# Altium schematic sheet RS232.SchDoc
size A
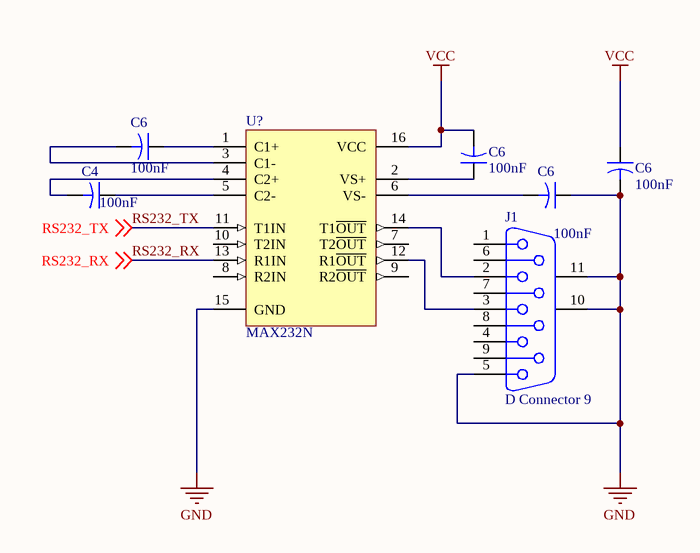
[diagram p0: RS232.SchDoc]

## Parts
(Parts that share a designator on the sheet are numbered #1, #2 ... from top to bottom, then left to right.)
C4  value 100nF  [0805]  (hidden comment: Cap2)
C6#1  value 100nF  [0805]  (hidden comment: Cap2)
C6#2  value 100nF  [0805]  (hidden comment: Cap2)
C6#3  value 100nF  [0805]  (hidden comment: Cap2)
C6#4  value 100nF  [0805]  (hidden comment: Cap2)
J1  D Connector 9  [DSUB1.385-2H9]
U?  MAX232N  [N016]

## Nets
GND: C6#3.2 C6#4.1 J1.5 J1.10(MH1) J1.11(MH2) U?.15(GND)
VCC: C6#2.2 C6#3.1 U?.16(VCC)
RS232_RX: U?.13(R1IN) ; off-sheet RS232_RX
RS232_TX: U?.11(T1IN) ; off-sheet RS232_TX
NetC4_1: C4.1 U?.5(C2-)
NetC4_2: C4.2 U?.4(C2+)
NetC6#1_1: C6#1.1 U?.1(C1+)
NetC6#1_2: C6#1.2 U?.3(C1-)
NetC6#2_1: C6#2.1 U?.2(VS+)
NetC6#4_2: C6#4.2 U?.6(VS-)
NetJ1_2: J1.2 U?.14(T1~{OUT})
NetJ1_3: J1.3 U?.12(R1~{OUT})

Not connected (* = marked no-connect by the designer): J1 1 4 6 7 8 9; U? 7(T2~{OUT}) 8(R2IN) 9(R2~{OUT}) 10(T2IN)

## Library data of the parts
C4 C6#1-C6#4 = Cap2: Capacitor; Published: 23-Sep-2002; PackageReference: CAPR5-4X5; Publisher: Altium Limited
J1 = D Connector 9: Receptacle Assembly, 9 Position, Right Angle; PackageDocument: O; Positions: 9; Published: 15-Jun-2001; LatestRevisionDate: 17-Jul-2002; LatestRevisionNote: Re-released for DXP Platform.; DatasheetDocument: 1-Sep-1999; PackageReference: 788750; Publisher: Altium Limited; Orientation: Right Angle; Gender: Receptacle
U? = MAX232N: Dual EIA-232 Driver/Receiver; Note: Receivers have typical hysteresis of 0.5V; Published: 15-May-2002; LatestRevisionDate: 04-Mar-2005; LatestRevisionNote: Stylized 3D Model Added.; DatasheetVersion: Jun-1989; PackageVersion: Oct-1995; PackageReference: N016; Publisher: Altium Limited; PackageDescription: DIP; 16 Leads; Row Spacing 7.62 mm; Pitch 2.54 mm; Code_JEDEC: MS-001-BB; ComponentLink1Description: Manufacturer Link; ComponentLink1URL: http://www.ti.com/; ComponentLink2Description: Datasheet; ComponentLink2URL: http://www-s.ti.com/sc/ds/max232.pdf